# Altium schematic sheet fleischerTowR3.SchDoc
size A2
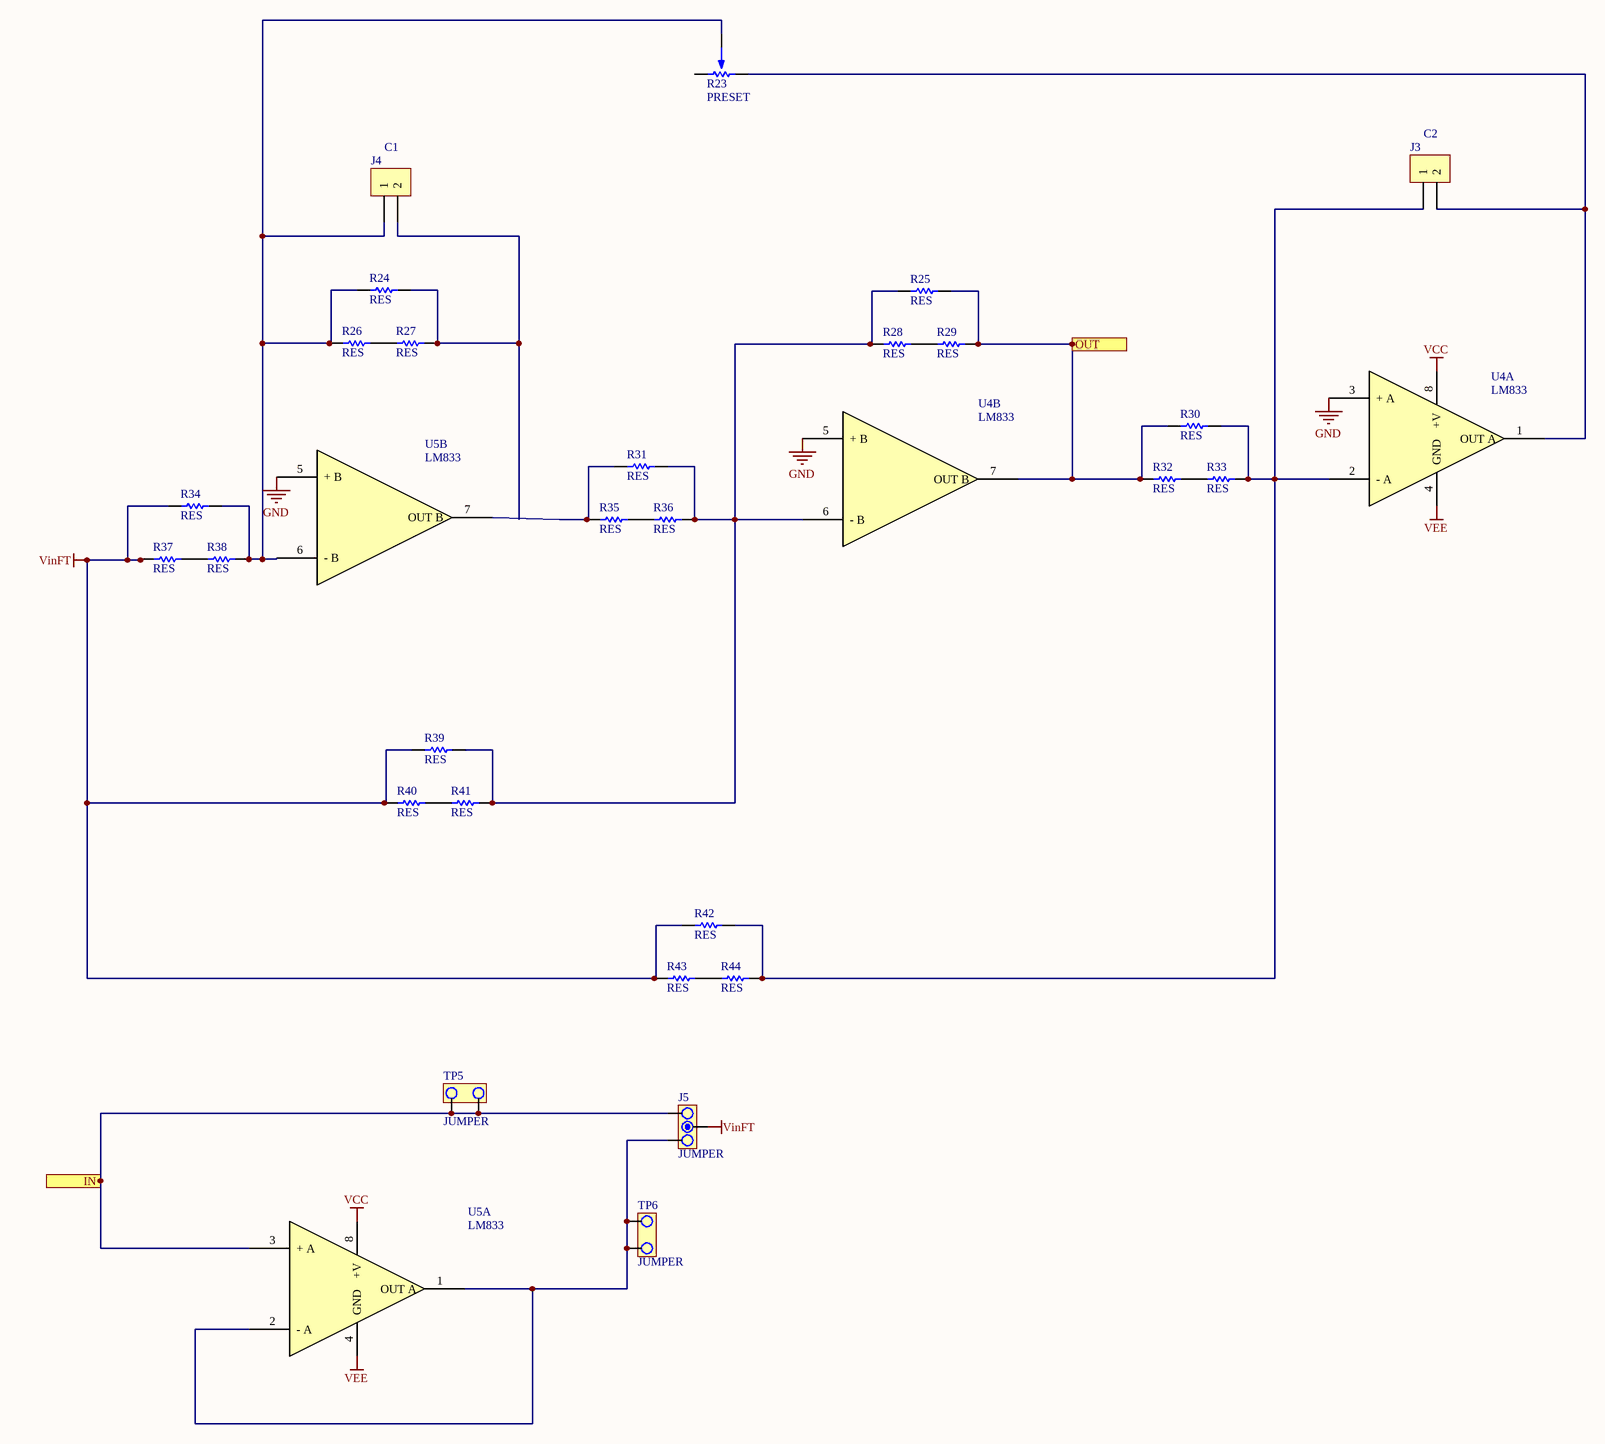
[diagram p0: fleischerTowR3.SchDoc]

## Parts
J3  C2  [SIP2]
J4  C1  [SIP2]
J5  JUMPER  [JUMPER3]
R23  PRESET  [PRESET H]
R24  RES  [0805]
R25  RES  [0805]
R26  RES  [0805]
R27  RES  [0805]
R28  RES  [0805]
R29  RES  [0805]
R30  RES  [0805]
R31  RES  [0805]
R32  RES  [0805]
R33  RES  [0805]
R34  RES  [0805]
R35  RES  [0805]
R36  RES  [0805]
R37  RES  [0805]
R38  RES  [0805]
R39  RES  [0805]
R40  RES  [0805]
R41  RES  [0805]
R42  RES  [0805]
R43  RES  [0805]
R44  RES  [0805]
TP5  JUMPER  [JUMPER2]
TP6  JUMPER  [JUMPER2]
U4  LM833  [DIP8]  (parts A,B of 2)
U5  LM833  [DIP8]  (parts A,B of 2)

## Ports
IN, OUT

## Nets
GND: U4.3(+_A) U4.5(+_B) U5.5(+_B)
VCC: U4.8(+V) U5.8(+V)
VEE: U4.4(GND) U5.4(GND)
VinFT: J5.2 R34.1 R37.1 R39.1 R40.1 R42.1 R43.1
IN: J5.3 TP5.1 TP5.2 U5.3(+_A) ; port IN
OUT: R25.2 R29.2 R30.1 R32.1 U4.7(OUT_B) ; port OUT
NetJ3_1: J3.1 R30.2 R33.2 R42.2 R44.2 U4.2(-_A)
NetJ3_2: J3.2 R23.3 U4.1(OUT_A)
NetJ4_1: J4.1 R23.2 R24.1 R26.1 R34.2 R38.2 U5.6(-_B)
NetJ4_2: J4.2 R24.2 R27.2
NetJ5_1: J5.1 TP6.1 TP6.2 U5.1(OUT_A) U5.2(-_A)
NetR25_1: R25.1 R28.1 R31.2 R36.2 R39.2 R41.2 U4.6(-_B)
NetR26_2: R26.2 R27.1
NetR28_2: R28.2 R29.1
NetR31_1: R31.1 R35.1 U5.7(OUT_B)
NetR32_2: R32.2 R33.1
NetR35_2: R35.2 R36.1
NetR37_2: R37.2 R38.1
NetR40_2: R40.2 R41.1
NetR43_2: R43.2 R44.1

Not connected (* = marked no-connect by the designer): R23 1

## Notes on the sheet
- Title
- Size:
- Date:
- File:
- A2
- Number:
- Time:
- Revision:
- Sheet
- of

## Library data of the parts
J3 J4 = CON2
J5 = JUMPER3
U4 U5 = LM833: Dual Audio Operational Amplifier